# Altium schematic sheet Schematic_of_device.SchDoc
size A3; SheetNumber: 1; SheetTotal: 1
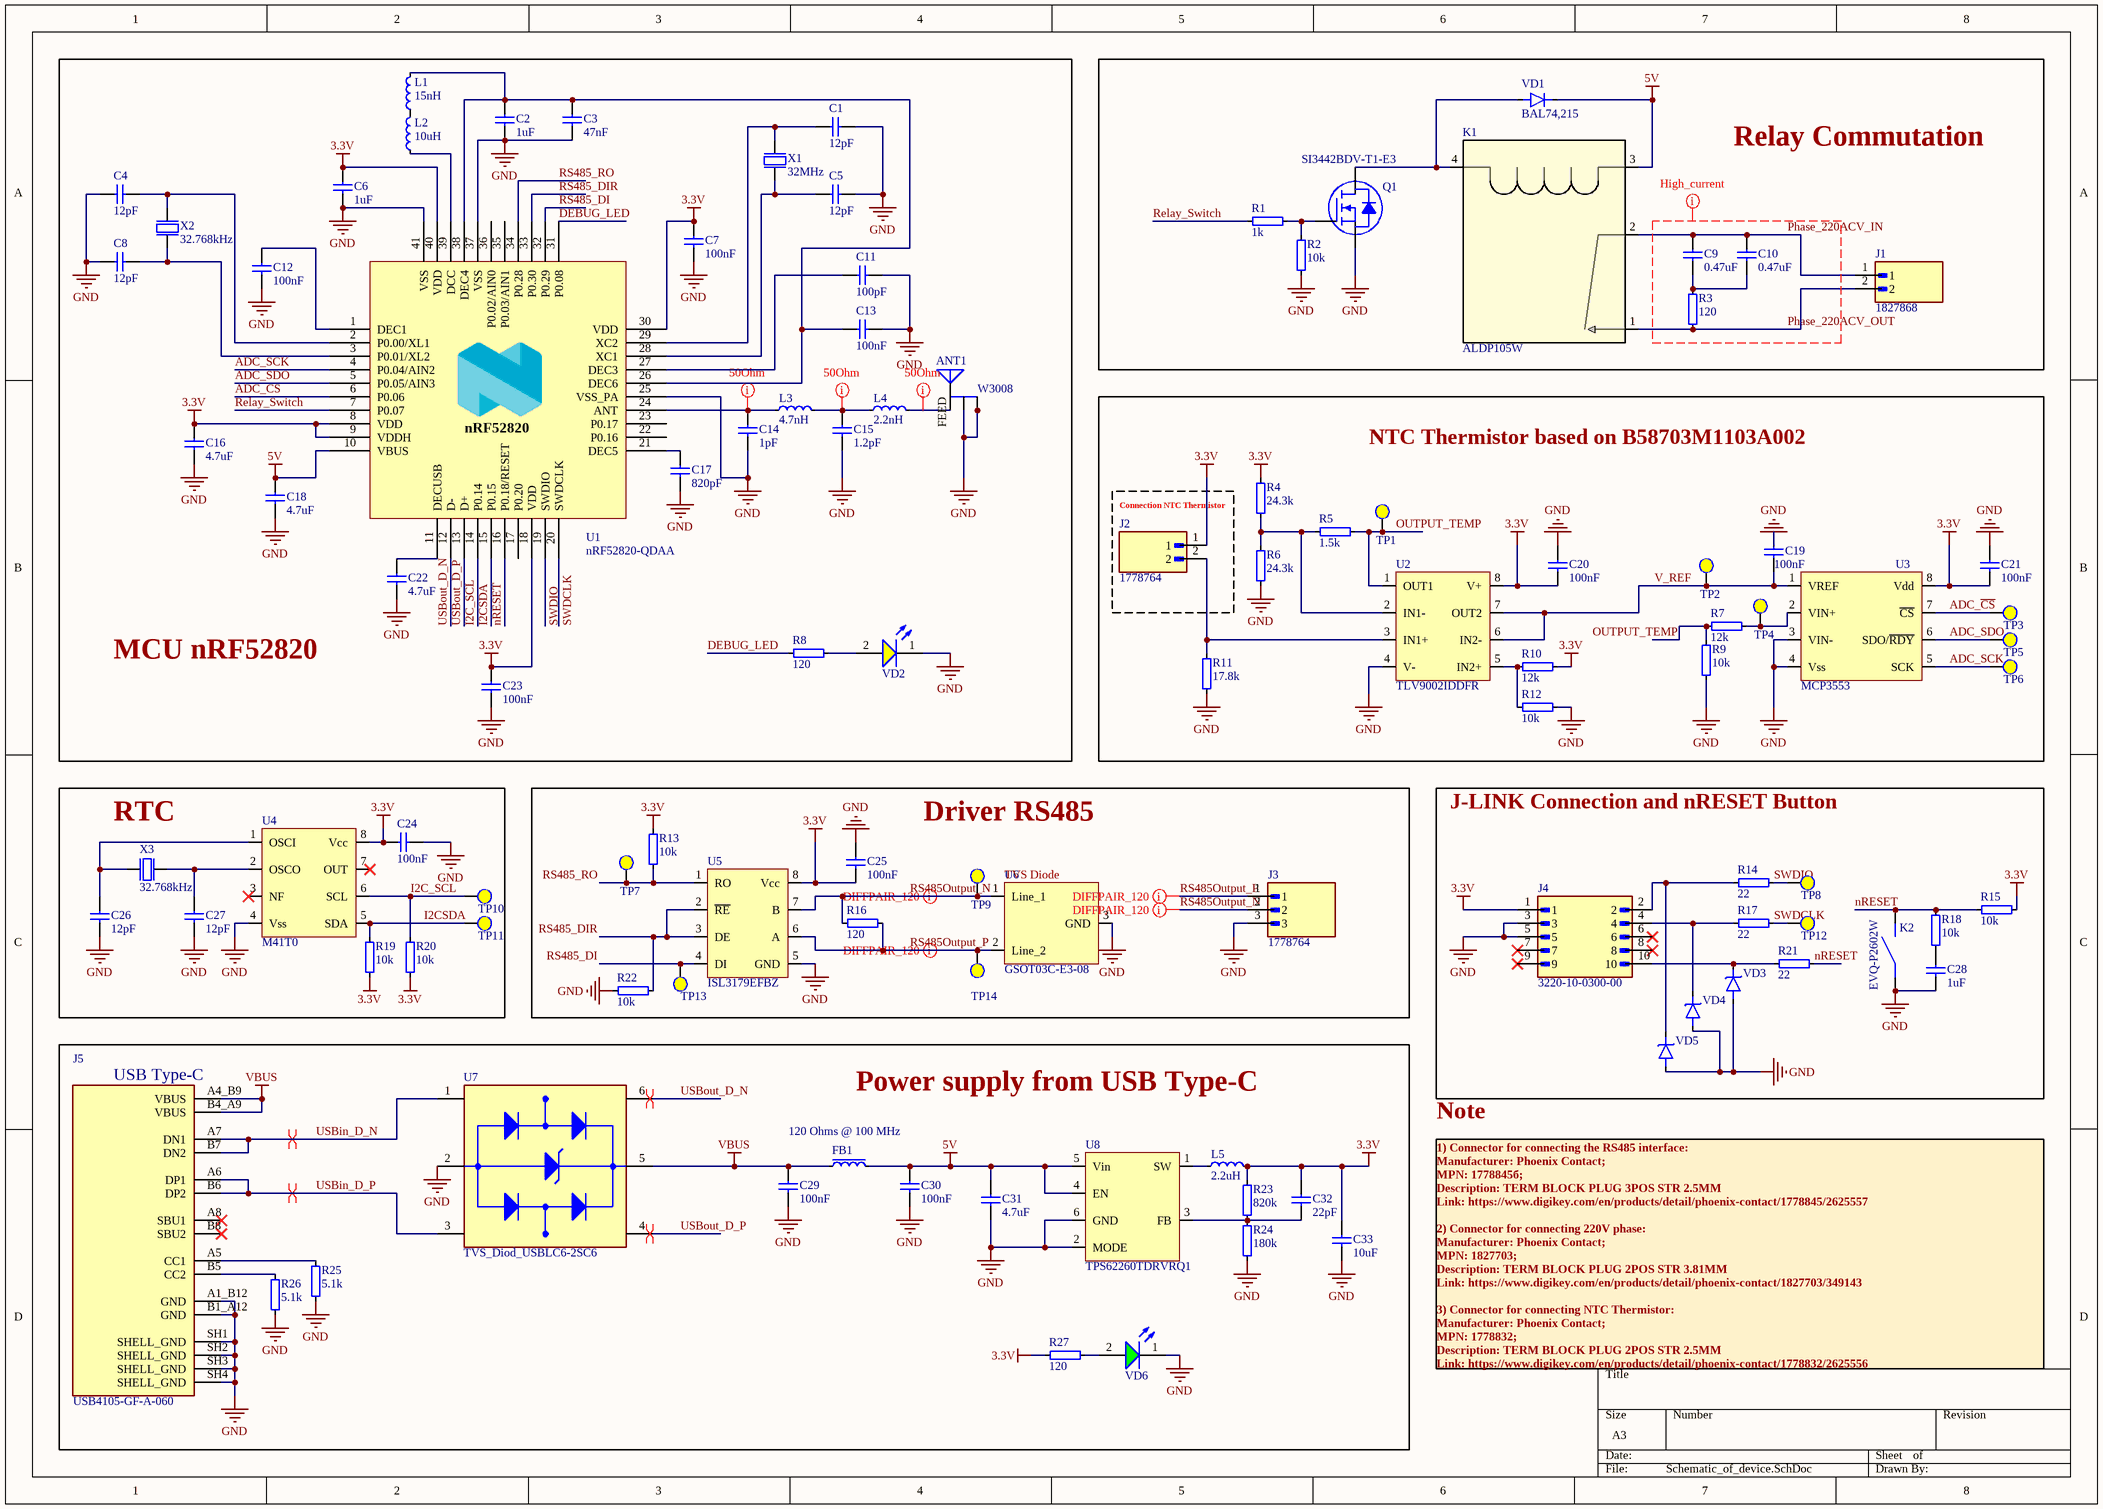
[diagram p0: Schematic_of_device.SchDoc]

## Parts
ANT1  W3008  [3]
C1  12pF  [C_Chip_0402]
C2  1uF  [C_Chip_0402]
C3  47nF  [C_Chip_0402]
C4  12pF  [C_Chip_0402]
C5  12pF  [C_Chip_0402]
C6  1uF  [C_Chip_0402]
C7  100nF  [C_Chip_0402]
C8  12pF  [C_Chip_0402]
C9  0.47uF  [C_Chip_1812]
C10  0.47uF  [C_Chip_1812]
C11  100pF  [C_Chip_0402]
C12  100nF  [C_Chip_0402]
C13  100nF  [C_Chip_0402]
C14  1pF  [C_Chip_0402]
C15  1.2pF  [C_Chip_0402]
C16  4.7uF  [C_Chip_0402]
C17  820pF  [C_Chip_0402]
C18  4.7uF  [C_Chip_0402]
C19  100nF  [C_Chip_0402]
C20  100nF  [C_Chip_0402]
C21  100nF  [C_Chip_0402]
C22  4.7uF  [C_Chip_0402]
C23  100nF  [C_Chip_0402]
C24  100nF  [C_Chip_0402]
C25  100nF  [C_Chip_0402]
C26  12pF  [C_Chip_0402]
C27  12pF  [C_Chip_0402]
C28  1uF  [C_Chip_0402]
C29  100nF  [C_Chip_0402]
C30  100nF  [C_Chip_0402]
C31  4.7uF  [C_Chip_0603]
C32  22pF  [C_Chip_0402]
C33  10uF  [C_Chip_0603]
FB1  120 Ohms @ 100 MHz  [Ferrite_Bead_0402]
J1  1827868  [Phoenix_1827868]
J2  1778764  [PHoenix_1778764]
J3  1778764  [Phoenix_1778777]
J4  3220-10-0300-00  [CNC_TECH_]
J5  USB4105-GF-A-060  [USB_TypeC_FP]
K1  ALDP105W  [Rekay]
K2  EVQ-P2602W  [Button]
L1  15nH  [L_Chip_0402]
L2  10uH  [L_Chip_0402]
L3  4.7nH  [L_Chip_0402]
L4  2.2nH  [L_Chip_0402]
L5  2.2uH  [L_Chip_1008]
Q1  SI3442BDV-T1-E3  [TSOP-6]
R1  1k  [R_Chip_0402]
R2  10k  [R_Chip_0402]
R3  120  [R_Chip_1210]
R4  24.3k  [R_Chip_0402]
R5  1.5k  [R_Chip_0402]
R6  24.3k  [R_Chip_0402]
R7  12k  [R_Chip_0402]
R8  120  [R_Chip_0402]
R9  10k  [R_Chip_0402]
R10  12k  [R_Chip_0402]
R11  17.8k  [R_Chip_0402]
R12  10k  [R_Chip_0402]
R13  10k  [R_Chip_0402]
R14  22  [R_Chip_0402]
R15  10k  [R_Chip_0402]
R16  120  [R_Chip_0402]
R17  22  [R_Chip_0402]
R18  10k  [R_Chip_0402]
R19  10k  [R_Chip_0402]
R20  10k  [R_Chip_0402]
R21  22  [R_Chip_0402]
R22  10k  [R_Chip_0402]
R23  820k  [R_Chip_0402]
R24  180k  [R_Chip_0402]
R25  5.1k  [R_Chip_0402]
R26  5.1k  [R_Chip_0402]
R27  120  [R_Chip_0402]
TP1  test point  [Test_Point]  (value not drawn)
TP2  test point  [Test_Point]  (value not drawn)
TP3  test point  [Test_Point]  (value not drawn)
TP4  test point  [Test_Point]  (value not drawn)
TP5  test point  [Test_Point]  (value not drawn)
TP6  test point  [Test_Point]  (value not drawn)
TP7  test point  [Test_Point]  (value not drawn)
TP8  test point  [Test_Point]  (value not drawn)
TP9  test point  [Test_Point]  (value not drawn)
TP10  test point  [Test_Point]  (value not drawn)
TP11  test point  [Test_Point]  (value not drawn)
TP12  test point  [Test_Point]  (value not drawn)
TP13  test point  [Test_Point]  (value not drawn)
TP14  test point  [Test_Point]  (value not drawn)
U1  nRF52820-QDAA  [QFN40P500X500X50_HS-41N]
U2  TLV9002IDDFR  [SOT23-8]
U3  MCP3553  [SOP8]
U4  M41T0  [8-SOIC]
U5  ISL3179EFBZ  [8-SOIC]
U6  GSOT03C-E3-08  [SOT23-3]
U7  TVS_Diod_USBLC6-2SC6  [SOT95P280X145-6N]
U8  TPS62260TDRVRQ1  [SON7P65_200X200X80L25X30T160X100N]
VD1  BAL74,215  [SOT23-3]
VD2  Yellow, 2V, 140°  [WL-SMCW_0603_150060xx75003]  (value not drawn)
VD3  SP3205-01ETG  [SP320501ETG]  (value not drawn)
VD4  SP3205-01ETG  [SP320501ETG]  (value not drawn)
VD5  SP3205-01ETG  [SP320501ETG]  (value not drawn)
VD6  Bright Green, 2V, 60°  [WL-SMCW_0603_150060xx75003]  (value not drawn)
X1  32MHz  [Osc_32MHz]
X2  32.768kHz  [Osc_32_768kHz]
X3  32.768kHz  [Osc_32_768kHz]

## Blocks framed on the sheet
MCU nRF52820: ANT1 C1-C8 C11-C18 C22 C23 L1-L4 R8 U1 VD2 X1 X2
Relay Сommutation: C9 C10 J1 K1 Q1 R1-R3 VD1
NTC Thermistor based on B58703M1103A002: C19-C21 R4-R7 R9-R12 TP1-TP6 U2 U3
Сonnection NTC Thermistor: J2
RTC: C24 C26 C27 R19 R20 TP10 TP11 U4 X3
J-LINK Connection and nRESET Button: C28 J4 K2 R14 R15 R17 R18 R21 TP8 TP12 VD3-VD5
Power supply from USB Type-C: C29-C33 FB1 J5 L5 R23-R27 U7 U8 VD6

## Nets
3.3V: C6.2 C7.2 C16.2 C20.2 C21.2 C23.2 C24.2 C25.1 C32.2 C33.2 J2.1 J4.1 L5.2 R4.2 R10.2 R13.2 R15.2 R19.1 R20.1 R23.2 R27.1 U1.8(VDD) U1.9(VDDH) U1.18(VDD) U1.30(VDD) U1.40(VDD) U2.8(V+) U3.8(Vdd) U4.8(Vcc) U5.8(Vcc)
5V: C18.2 C30.2 C31.2 FB1.2 K1.3 U1.10(VBUS) U8.4(EN) U8.5(Vin) VD1.3
GND: ANT1.G1(GND) ANT1.G2(GND) C1.2 C2.1 C3.1 C4.1 C5.2 C6.1 C7.1 C8.1 C11.2 C12.1 C13.2 C14.1 C15.1 C16.1 C17.1 C18.1 C19.2 C20.1 C21.1 C22.1 C23.1 C24.1 C25.2 C26.1 C27.1 C28.2 C29.1 C30.1 C31.1 C33.1 J3.3 J4.3 J4.5 J5.A1_B12(GND) J5.B1_A12(GND) J5.SH1(SHELL_GND) J5.SH2(SHELL_GND) J5.SH3(SHELL_GND) J5.SH4(SHELL_GND) K2.1 Q1.3(S) R2.1 R6.1 R9.1 R11.1 R12.1 R22.1 R24.1 R25.1 R26.1 U1.25(VSS_PA) U1.37(VSS) U1.41(VSS) U2.4(V-) U3.3(VIN-) U3.4(Vss) U4.4(Vss) U5.5(GND) U6.3(GND) U7.2(GND) U8.2(MODE) U8.6(GND) VD2.1(K) VD3.2 VD4.2 VD5.2 VD6.1(K)
VBUS: C29.2 FB1.1 J5.A4_B9(VBUS) J5.B4_A9(VBUS) U7.5(VBUS)
ADC_~{CS}: TP3.1 U1.6(P0.06) U3.7(~{CS})
ADC_SCK: TP6.1 U1.4(P0.04/AIN2) U3.5(SCK)
ADC_SDO: TP5.1 U1.5(P0.05/AIN3) U3.6(SDO/~{RDY})
DEBUG_LED: R8.1 U1.31(P0.08)
I2C_SCL: R20.2 TP10.1 U1.14(P0.14) U4.6(SCL)
I2CSDA: R19.2 TP11.1 U1.15(P0.15) U4.5(SDA)
nRESET: K2.4 R15.1 R18.1 R21.2 U1.16(P0.18/RESET)
OUTPUT_TEMP: R5.2 R7.1 R9.2 TP1.1 U2.1(OUT1)
Phase_220ACV_IN: C9.2 C10.2 J1.1 K1.2
Phase_220ACV_OUT: J1.2 K1.1 R3.1
Relay_Switch: R1.1 U1.7(P0.07)
RS485_DI: TP13.1 U1.32(P0.29) U5.4(DI)
RS485_DIR: R22.2 U1.33(P0.30) U5.2(~{RE}) U5.3(DE)
RS485_RO: R13.1 TP7.1 U1.34(P0.28) U5.1(RO)
RS485Output_N: J3.2 R16.1 TP9.1 U5.7(B) U6.1(Line_1)
RS485Output_P: J3.1 R16.2 TP14.1 U5.6(A) U6.2(Line_2)
SWDCLK: R17.2 TP12.1 U1.20(SWDCLK)
SWDIO: R14.2 TP8.1 U1.19(SWDIO)
USBin_D_N: J5.A7(DN1) J5.B7(DN2) U7.1(I/O1_IN)
USBin_D_P: J5.A6(DP1) J5.B6(DP2) U7.3(I/O2_IN)
USBout_D_N: U1.12(D-) U7.6(I/O1_OUT)
USBout_D_P: U1.13(D+) U7.4(I/O2_OUT)
V_REF: C19.1 TP2.1 U2.6(IN2-) U2.7(OUT2) U3.1(VREF)
NetANT1_FEED: ANT1.FEED L4.2
NetC1_1: C1.1 U1.29(XC2) X1.3(out)
NetC2_2: C2.2 C3.2 C13.1 L1.2 U1.26(DEC6) U1.38(DEC4)
NetC4_2: C4.2 U1.2(P0.00/XL1) X2.1(inp)
NetC5_1: C5.1 U1.28(XC1) X1.1(inp)
NetC8_2: C8.2 U1.3(P0.01/XL2) X2.2(out)
NetC9_1: C9.1 C10.1 R3.2
NetC11_1: C11.1 U1.27(DEC3)
NetC12_2: C12.2 U1.1(DEC1)
NetC14_2: C14.2 L3.1 U1.24(ANT)
NetC15_2: C15.2 L3.2 L4.1
NetC17_2: C17.2 U1.21(DEC5)
NetC22_2: C22.2 U1.11(DECUSB)
NetC26_2: C26.2 U4.1(OSCI) X3.2(out)
NetC27_2: C27.2 U4.2(OSCO) X3.1(inp)
NetC28_1: C28.1 R18.2
NetC32_1: C32.1 R23.1 R24.2 U8.3(FB)
NetJ2_2: J2.2 R11.2 U2.3(IN1+)
NetJ4_2: J4.2 R14.1 VD5.1
NetJ4_4: J4.4 R17.1 VD4.1
NetJ4_10: J4.10 R21.1 VD3.1
NetJ5_A5: J5.A5(CC1) R25.2
NetJ5_B5: J5.B5(CC2) R26.2
NetK1_4: K1.4 Q1.2(D) VD1.2
NetL1_1: L1.1 L2.2
NetL2_1: L2.1 U1.39(DCC)
NetL5_1: L5.1 U8.1(SW)
NetQ1_1: Q1.1(G) R1.2 R2.2
NetR4_1: R4.1 R5.1 R6.2 U2.2(IN1-)
NetR7_2: R7.2 TP4.1 U3.2(VIN+)
NetR8_2: R8.2 VD2.2(A)
NetR10_1: R10.1 R12.2 U2.5(IN2+)
NetR27_2: R27.2 VD6.2(A)

Not connected (* = marked no-connect by the designer): J4 6* 7* 8* 9*; J5 A8(SBU1)* B8(SBU2)*; U1 17(P0.20) 22(P0.16) 23(P0.17) 35(P0.03/AIN1) 36(P0.02/AIN0); U4 3(NF)* 7(OUT)*

## Layout directives
differential pair; differential pair class USB: USBin_D_N, USBin_D_P, USBout_D_N, USBout_D_P
differential pair; differential pair class 120: RS485Output_N, RS485Output_P
net class 50Ohm: NetANT1_FEED, NetC14_2, NetC15_2
net class 220_Nets: Phase_220ACV_IN, Phase_220ACV_OUT

## Notes on the sheet
- Driver RS485
- (near U6) TVS Diode
- Note
- 1) Connector for connecting the RS485 interface:
  Manufacturer: Phoenix Contact;
  MPN: 1778845б;
  Description: TERM BLOCK PLUG 3POS STR 2.5MM
  Link: https://www.digikey.com/en/products/detail/phoenix-contact/1778845/2625557
  2) Connector for connecting 220V phase:
  Manufacturer: Phoenix Contact;
  MPN: 1827703;
  Description: TERM BLOCK PLUG 2POS STR 3.81MM
  Link: https://www.digikey.com/en/products/detail/phoenix-contact/1827703/349143
  3) Connector for connecting NTC Thermistor:
  Manufacturer: Phoenix Contact;
  MPN: 1778832;
  Description: TERM BLOCK PLUG 2POS STR 2.5MM
  Link: https://www.digikey.com/en/products/detail/phoenix-contact/1778832/2625556
- (in symbol nRF52820-QDAA) nRF52820
- (in symbol USB_TypeC) USB Type-C

## Library data of the parts
ANT1 = W3008: 2.4GHz Bluetooth, WLAN, Zigbeeâ„¢ Chip RF Antenna 2.4GHz ~ 2.483GHz 2.2dBi Solder Surface Mount; MF: PulseLarsen Antennas; Check_prices: https://www.snapeda.com/parts/W3008/PulseLarsen+Antennas/view-part/?ref=eda; Value: *; Availability: In Stock; MP: W3008; Price: None; Package: None; SnapEDA_Link: https://www.snapeda.com/parts/W3008/PulseLarsen+Antennas/view-part/?ref=snap; Purchase-URL: https://pricing.snapeda.com/search/part/W3008/?ref=eda
C1 C4 C5 C8 C26 C27 = С_Chip_0402_12p: CAP CER 12PF 200V NP0 0402; Manufacturer: Murata Electronics; MPN: GQM1555C2D120FB01D; Tolerance: ±1%; Capacitance: 12pF; Link: https://www.digikey.com/en/products/detail/murata-electronics/GQM1555C2D120FB01D/5881957; Voltage: 200V
C2 C6 C28 = С_Chip_0402_1u: CAP CER 1UF 10V X7R 0402; Manufacturer: Murata Electronics; MPN: GRM155Z71A105KE01J; Tolerance: ±10%; Capacitance: 1uF; Link: https://www.digikey.com/en/products/detail/murata-electronics/GRM155Z71A105KE01J/16033607; Voltage: 10V
C3 = С_Chip_0402_47n: CAP CER 0.047UF 50V X7R 0402; Manufacturer: Murata Electronics; MPN: GRM155R71H473KE14D; Tolerance: ±10%; Capacitance: 47nF; Link: https://www.digikey.com/en/products/detail/murata-electronics/GRM155R71H473KE14D/4905190; Voltage: 50V
C7 C12 C13 C19-C21 C23-C25 C29 C30 = С_Chip_0402_100n: CAP CER 0.1UF 50V X7R 0402; Manufacturer: Murata Electronics; MPN: GCM155R71H104KE02D; Tolerance: ±10%; Capacitance: 100nF; Link: https://www.digikey.com/en/products/detail/murata-electronics/GCM155R71H104KE02D/4903704; Voltage: 50V
C9 C10 = С_Chip_1812_0u47: CAP CER 0.47UF 500V X7R 1812; Manufacturer: Holy Stone Enterprise Co., Ltd.; MPN: C1812X474K501T; Tolerance: ±10%; Capacitance: 0.47uF; Link: digikey.com/en/products/detail/holy-stone-enterprise-co-ltd/C1812X474K501T/16895223; Voltage: 500V
C11 = С_Chip_0402_100p: CAP CER 100PF 50V X7R 0402; Manufacturer: Würth Elektronik; MPN: 885012205055; Tolerance: ±10%; Capacitance: 100pF; Link: https://www.digikey.com/en/products/detail/w%C3%BCrth-elektronik/885012205055/5453405; Voltage: 50V
C14 = С_Chip_0402_1p: CAP CER 1PF 50V C0G/NP0 0402; Manufacturer: Murata Electronics; MPN: GJM1555C1H1R0WB01D; Tolerance: ±0.05pF; Capacitance: 1pF; Link: https://www.digikey.com/en/products/detail/murata-electronics/GJM1555C1H1R0WB01D/2592867; Voltage: 50V
C15 = С_Chip_0402_1p2: CAP CER 1.2PF 50V C0G/NP0 0402; Manufacturer: Murata Electronics; MPN: GRM1555C1H1R2BA01D; Tolerance: ±0.1pF; Capacitance: 1.2pF; Link: https://www.digikey.com/en/products/detail/murata-electronics/GRM1555C1H1R2BA01D/3693934; Voltage: 50V
C16 C18 C22 = С_Chip_0402_4u7: CAP CER 4.7UF 16V X6T 0402; Manufacturer: Murata Electronics; MPN: GRM155D81C475ME15J; Tolerance: ±20%; Capacitance: 4.7uF; Link: https://www.digikey.com/en/products/detail/murata-electronics/GRM155D81C475ME15J/16821358; Voltage: 16V
C17 = С_Chip_0402_820p: CAP CER 820PF 50V X7R 0402; Manufacturer: Murata Electronics; MPN: GRM155R71H821KA01D; Tolerance: ±10%; Capacitance: 820pF; Link: https://www.digikey.com/en/products/detail/murata-electronics/GRM155R71H821KA01D/702515; Voltage: 50V
C31 = С_Chip_0603_4u7: CAP CER 4.7UF 16V X7R 0603; Manufacturer: Murata Electronics; MPN: GRM188Z71C475KE21D; Tolerance: ±10%; Capacitance: 4.7uF; Link: digikey.com/en/products/detail/murata-electronics/GRM188Z71C475KE21D/13401930; Voltage: 16V
C32 = С_Chip_0402_22p: CAP CER 22PF 16V X7R 0402; Manufacturer: KEMET; MPN: C0402C220K4RAC7867; Tolerance: ±10%; Capacitance: 22pF; Link: https://www.digikey.com/en/products/detail/kemet/C0402C220K4RAC7867/8572389; Voltage: 16V
C33 = С_Chip_0603_10u: CAP CER 10UF 10V X7R 0603; Manufacturer: Murata Electronics; MPN: GRM188Z71A106MA73D; Tolerance: ±20%; Capacitance: 10uF; Link: https://www.digikey.com/en/products/detail/murata-electronics/GRM188Z71A106MA73D/14290094; Voltage: 10V
FB1 = Ferrite_Beads: FERRITE BEAD 120 OHM 0402 1LN; Manufacturer: Laird-Signal Integrity Products; MPN: LI0402D121R-10; Max current: 400mA; Package: 0402; Impedance @ Frequency: 120 Ohms @ 100 MHz; Link: https://www.digikey.com/en/products/detail/laird-signal-integrity-products/LI0402D121R-10/806601
J1 = Phoenix_2pin_male: TERM BLOCK HDR 2POS 90DEG 3.81MM; Manufacturer: Phoenix Contact; MPN: 1827868; Link: https://www.digikey.com/en/products/detail/phoenix-contact/1827868/349156
J2 = Male_2_Position_Terminal_Block_Header: TERM BLOCK HDR 2POS 90DEG 2.5MM; Manufacturer: Phoenix Contact; MPN: 1778764; Link: https://www.digikey.com/en/products/detail/phoenix-contact/1778764/2625549
J3 = Male_3_Position_Terminal_Block_Header: TERM BLOCK HDR 3POS 90DEG 2.5MM; Manufacturer: Phoenix Contact; MPN: 1778777; Link: https://www.digikey.com/en/products/detail/phoenix-contact/1778777/2625550
J4 = 3220-10-0300-00: CONN HEADER SMD 10POS 1.27MM; Manufacturer: CNC Tech; MPN: 3220-10-0300-00; Link: https://www.digikey.com/en/products/detail/cnc-tech/3220-10-0300-00/3883266
J5 = USB_TypeC: CONN RCP USB2.0 TYP C 24P SMD RA; Manufacturer: GCT; MPN: USB4105-GF-A-060; Link: https://www.digikey.com/en/products/detail/gct/usb4105-gf-a-060/14559036
K1 = Relay: RELAY GEN PURPOSE SPST 5A 5V; Manufacturer: Panasonic Electric Works; MPN: ALDP105W; Link: https://www.digikey.com/en/products/detail/panasonic-electric-works/ALDP105W/3641417
K2 = Button: SWITCH TACTILE SPST-NO 0.02A 15V; Manufacturer: Panasonic Electronic Components; MPN: EVQ-P2602W; Link: https://www.digikey.com/en/products/detail/panasonic-electronic-components/EVQ-P2602W/593465
L1 = L_Chip_0402_15n: FIXED IND 15NH 250MA 600MOHM SMD; Manufacturer: Johanson Technology Inc.; MPN: LRC0402CJ15NGV001T; Inductance: 15nH; Link: https://www.digikey.com/en/products/detail/johanson-technology-inc/LRC0402CJ15NGV001T/1840068
L2 = L_Chip_0402_10u: FIXED IND 10UH 380MA 468MOHM SMD; Manufacturer: Taiyo Yuden; MPN: CBMF1608T100K; Inductance: 10uH; Link: https://www.digikey.com/en/products/detail/taiyo-yuden/CBMF1608T100K/1007994
L3 = L_Chip_0402_4n7: FIXED IND 4.7NH 700MA 0.16OHM SM; Manufacturer: Murata Electronics; MPN: LQG15HS4N7S02D; Inductance: 4.7nH; Link: https://www.digikey.com/en/products/detail/murata-electronics/LQG15HS4N7S02D/662867
L4 = L_Chip_0402_2n2: FIXED IND 2.2NH 900MA 150MOHM SM; Manufacturer: TDK Corporation; MPN: MLG1005S2N2BT000; Inductance: 2.2nH; Link: https://www.digikey.com/en/products/detail/tdk-corporation/MLG1005S2N2BT000/4742728
L5 = L_Chip_1008_2u2: FIXED IND 2.2UH 1A 150 MOHM SMD; Manufacturer: Murata Electronics; MPN: LQM2HPN2R2MJ0L; Inductance: 2.2uH; Link: https://www.digikey.com/en/products/detail/murata-electronics/LQM2HPN2R2MJ0L/2594611?s=N4IgTCBcDaIDIEUCyYASAFAcmASmJAUgAxwgC6AvkA
Q1 = N-chenal_MOSFET: MOSFET N-CH 20V 3A 6TSOP; Manufacturer: Vishay Siliconix; MPN: SI3442BDV-T1-E3; Link: https://www.digikey.com/en/products/detail/vishay-siliconix/SI3442BDV-T1-E3/1656365
R1 = R_Chip_0402_1k: RES 1K OHM 1% 1/8W 0402; Manufacturer: YAGEO; MPN: AC0402FR-7W1KL; Link: https://www.digikey.com/en/products/detail/yageo/AC0402FR-7W1KL/16991527; Power: 1/8W; Resistance: 1k; Tolerance: ±1%
R2 R9 R12 R13 R15 R18-R20 R22 = R_Chip_0402_10k: RES 10K OHM 1% 1/8W 0402; Manufacturer: TE Connectivity Passive Product; MPN: CRGP0402F10K; Link: https://www.digikey.com/en/products/detail/te-connectivity-passive-product/CRGP0402F10K/8576969; Power: 1/8W; Resistance: 10k; Tolerance: ±1%
R3 = R_Chip_1210_120: RES 120 OHM 1% 1W 1210; Manufacturer: YAGEO; MPN: AC1210FR-7W120RL; Link: https://www.digikey.com/en/products/detail/yageo/AC1210FR-7W120RL/17007200; Power: 1W; Resistance: 120; Tolerance: ±1%
R4 R6 = R_Chip_0402_24k3: RES 24.3K OHM 1% 1/8W 0402; Manufacturer: YAGEO; MPN: AC0402FR-7W24K3L; Link: https://www.digikey.com/en/products/detail/yageo/AC0402FR-7W24K3L/16989834?s=N4IgjCBcoExaBjKAzAhgGwM4FMA0IB7KAbXAAYAOAdgE4QBdfABwBcoQBlFgJwEsA7AOYgAvvjAA2eCCSQ0WPIRIgAzDTABWCg2ZtInHgOFiQMShumz5OfEUikYAFgB0KgAQBrAPIALALaYOiCs7ACq-LwsXsgAstiomACu3Nii%2BAC0cNAyUDyJinakFvQipUA; Power: 1/8W; Resistance: 24.3k; Tolerance: ±1%
R5 = R_Chip_0402_1k5: RES 1.5K OHM 1% 1/8W 0402; Manufacturer: TE Connectivity Passive Product; MPN: CRGP0402F1K5; Link: https://www.digikey.com/en/products/detail/te-connectivity-passive-product/CRGP0402F1K5/8576959; Power: 1/8W; Resistance: 1.5k; Tolerance: ±1%
R7 R10 = R_Chip_0402_12k: RES 12K OHM 1% 1/8W 0402; Manufacturer: TE Connectivity Passive Product; MPN: CRGP0402F12K; Link: https://www.digikey.com/en/products/detail/te-connectivity-passive-product/CRGP0402F12K/8576970; Power: 1/8W; Resistance: 12k; Tolerance: ±1%
R8 R16 R27 = R_Chip_0402_120: RES 120 OHM 1% 1/8W 0402; Manufacturer: TE Connectivity Passive Product; MPN: CRGP0402F120R; Link: https://www.digikey.com/en/products/detail/te-connectivity-passive-product/CRGP0402F120R/8576946; Power: 1/8W; Resistance: 120; Tolerance: ±1%
R11 = R_Chip_0402_17k8: RES SMD 17.8K OHM 1% 1/10W 0402; Manufacturer: Panasonic Electronic Components; MPN: ERJ-2RKF1782X; Link: https://www.digikey.com/en/products/detail/panasonic-electronic-components/ERJ-2RKF1782X/192173; Power: 1/10W; Resistance: 17.8k; Tolerance: ±1%
R14 R17 R21 = R_Chip_0402_22: RES SMD 22 OHM 1% 1/10W 0402; Manufacturer: Panasonic Electronic Components; MPN: ERJ-2RKF22R0X; Link: https://www.digikey.com/en/products/detail/panasonic-electronic-components/ERJ-2RKF22R0X/1746157; Power: 1/10W; Resistance: 22; Tolerance: ±1%
R23 = R_Chip_0402_820k: RES 820K OHM 1% 1/4W 0402; Manufacturer: Panasonic Electronic Components; MPN: ERJ-PA2F8203X; Link: https://www.digikey.com/en/products/detail/panasonic-electronic-components/ERJ-PA2F8203X/9815371; Power: 1/4W; Resistance: 820k; Tolerance: ±1%
R24 = R_Chip_0402_180k: RES 180K OHM 1% 1/4W 0402; Manufacturer: Panasonic Electronic Components; MPN: ERJ-PA2F1803X; Link: https://www.digikey.com/en/products/detail/panasonic-electronic-components/ERJ-PA2F1803X/9815006; Power: 1/4W; Resistance: 180k; Tolerance: ±1%
R25 R26 = R_Chip_0402_5k1: RES 5.1K OHM 1% 1/8W 0402; Manufacturer: YAGEO; MPN: RC0402FR-7W5K1L; Link: https://www.digikey.com/en/products/detail/yageo/RC0402FR-7W5K1L/17018192; Power: 1/8W; Resistance: 5.1k; Tolerance: ±1%
TP1-TP14 = Test_Point
U1 = nRF52820-QDAA: Multi-protocol Bluetooth Low Energy, IEEE 802.15.4, ANT and 2.4GHz proprietary system-on-chip; Part Number: nRF52820-QDAA; LatestRevisionDate: 2019-10-01; Pin Count: 40; Publisher: Nordic Semiconductor; Published: 2019-10-01; Value: nRF52820-QDAA; Footprint Doc: QFN-40; Manufacturer: ?; MPN: ?; ComponentLink1Description: Link; ComponentLink1URL: *; Tolerance: ?; Package: ?
U2 = OP_AMP_TLV9002IDDFR: Manufacturer: Texas Instruments; MPN: TLV9002IDDFR; Link: https://www.digikey.com/en/products/detail/texas-instruments/TLV9002IDDFR/10715502
U3 = ADC_MCP3553: IC ADC 22BIT SIGMA-DELTA 8MSOP; MPN: MCP3553T-E/MS; Monufacturer: Microchip Technology; Package: 8-MSOP; Link: https://www.digikey.com/en/products/detail/microchip-technology/MCP3553T-E-MS/964284
U4 = RTC_M41T0: IC RTC CLK/CALENDAR I2C 8SOIC; MPN: M41T0M6F; Monufacturer: STMicroelectronics; Package: 8-SOIC; Link: https://www.digikey.com/en/products/detail/stmicroelectronics/M41T0M6F/868911?s=N4IgTCBcDaILIBYCMAVADHAbAMRAXQF8g
U5 = RS485_ISL3179EFBZ: IC TRANSCEIVER HALF 1/1 8SOIC; Monufacturer: Renesas Electronics Corporation; MPN: ISL3179EFBZ; Link: https://www.digikey.com/en/products/detail/renesas-electronics-corporation/ISL3179EFBZ/1879490; Pacage: 8-SOIC
U6 = TVS_D_GSOT03C-E3-08: TVS DIODE 3.3VWM 12.3VC SOT23-3; Manufacturer: Vishay General Semiconductor - Diodes Division; MPN: GSOT03C-E3-08; Link: https://www.digikey.com/en/products/detail/vishay-general-semiconductor-diodes-division/GSOT03C-E3-08/1680560
U7 = TVS_Diod_USBLC6-2SC6: 17V Clamp 5A (8/20Âµs) Ipp Tvs Diode Surface Mount SOT-23-6; MF: STMicroelectronics; Value: *; SnapEDA_Link: https://www.snapeda.com/parts/USBLC6-2SC6/STMicroelectronics/view-part/?ref=snap; Check_prices: https://www.snapeda.com/parts/USBLC6-2SC6/STMicroelectronics/view-part/?ref=eda; Purchase-URL: https://pricing.snapeda.com/search/part/USBLC6-2SC6/?ref=eda; Price: None; Availability: In Stock; Package: SOT-23-6 STMicroelectronics; MP: USBLC6-2SC6
U8 = TPS62260TDRVRQ1: IC REG BUCK ADJ 600MA 6WSON; Manufacturer: Texas Instruments; MPN: TPS62260TDRVRQ1; Link: https://www.digikey.com/en/products/detail/texas-instruments/TPS62260TDRVRQ1/3503800?s=N4IgTCBcDaICoAUDKA2MYUAY4BEBKAangIoCMIAugL5A
VD1 = D_BAL74_215: DIODE GEN PURP 50V 215MA TO236AB; Manufacturer: Nexperia USA Inc.; MPN: BAL74,215; Link: https://www.digikey.com/en/products/detail/nexperia-usa-inc/BAL74-215/1127177
VD2 = 150060YS75000: WL-SMCW Mono-color Chip LED Waterclear, size 0603, Yellow, 2V, 140°; Manufacturer: Wurth Elektronik; Case/Size Code: 0603; Chip Technology: AlInGaP; Dominant Wavelength: 590nm; Luminous Intensity: 120mcd; Peak Wavelength: 595nm; Manufacturer Part Number: 150060YS75000; Category: Signal LEDs; Match Code: WL-SMCW; ComponentLink1Description: Website Link; ComponentLink1URL: https://www.we-online.com/redexpert/article/150060YS75000?ad; ComponentLink2Description: Datasheet Link; ComponentLink2URL: https://www.we-online.com/redexpert/spec/150060YS75000?ad; Mount: Surface Mount; Operating Temperature Max: 85°C; Operating Temperature Min: -40°C; Packaging: Tape and Reel; Length: 1.6mm; Width: 0.8mm; Height: 0.7mm; Emitting Color: Yellow; Forward Voltage: 2V; Viewing Angle: 140°; Link: https://www.digikey.com/en/products/detail/w%C3%BCrth-elektronik/150060YS75000/4489909
VD3-VD5 = TVS_diode_1chenal: TVS DIODE 3.3VWM 12VC SOD882; Manufacturer: Littelfuse Inc.; MPN: SP3205-01ETG; Link: https://www.digikey.com/en/products/detail/littelfuse-inc/SP3205-01ETG/12154656
VD6 = 150060VS86000: WL-SMCW Mono-color Chip LED Waterclear, size 0603, Bright Green, 2V, 60°; Manufacturer: Wurth Elektronik; Case/Size Code: 0603; Chip Technology: AlInGaP; Dominant Wavelength: 573nm; Luminous Intensity: 300mcd; Peak Wavelength: 575nm; Manufacturer Part Number: 150060VS86000; Category: Signal LEDs; Match Code: WL-SMCW; ComponentLink1Description: Website Link; ComponentLink1URL: https://www.we-online.com/redexpert/article/150060VS86000?ad; ComponentLink2Description: Datasheet Link; ComponentLink2URL: https://www.we-online.com/redexpert/spec/150060VS86000?ad; Mount: Surface Mount; Operating Temperature Max: 85°C; Operating Temperature Min: -40°C; Packaging: Tape and Reel; Length: 1.6mm; Width: 0.8mm; Height: 0.95mm; Emitting Color: Bright Green; Forward Voltage: 2V; Viewing Angle: 60°; Link: https://www.digikey.com/en/products/detail/w%C3%BCrth-elektronik/150060VS75000/4489906
X1 = X_Crystal_32MHz: Manufacturer: Suntsu Electronics, Inc; MPN: SXT3248AA48-32.000M; Value: 32MHz; ComponentLink1Description: Link; ComponentLink1URL: *; Tolerance: ?; Package: ?
X2 X3 = X_Crystal_32_768kHz: Manufacturer: Raltron Electronics; MPN: RT2012-32.768-9-TR; Value: 32.768kHz; ComponentLink1Description: Link; ComponentLink1URL: *; Tolerance: ?; Package: ?